# Altium schematic sheet [04] - IC_Power_Monitor_v0.2.SchDoc
size A4
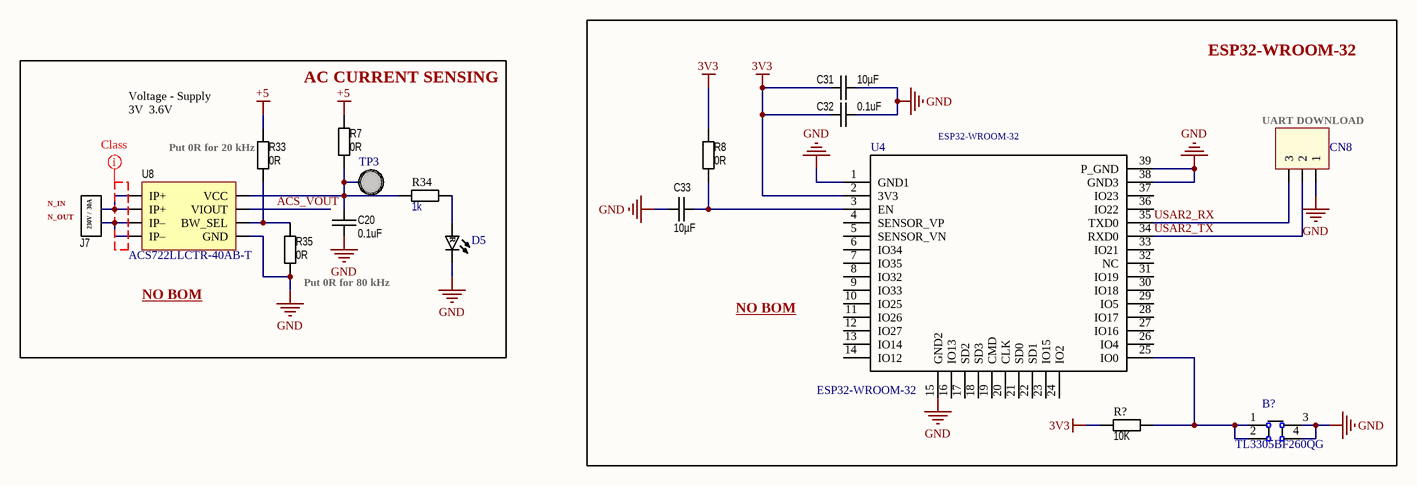
[diagram p0: [04] - IC_Power_Monitor_v0.2.SchDoc]

## Parts
B?  TL3305BF260QG  [Switch]
C20  value 0.1uF  [CAP 0603/1608]  (hidden comment: C0603C104M5RACTU)
C31  value 10µF  [CAP 0603/1608]  (hidden comment: GRM188R61E106MA73D)
C32  value 0.1uF  [CAP 0603/1608]  (hidden comment: C0603C104M5RACTU)
C33  value 10µF  [CAP 0603/1608]  (hidden comment: GRM188R61E106MA73D)
CN8  87220-3  [Terminal_3]  (value not drawn)  (no BOM)
D5  SML-D12U1WT86  [LED-0603]  (value not drawn)
J7  1868076  [30Amp_Connector]  (value not drawn)
R7  value 0R  [R0603]  (hidden comment: RES 0R 0603 JUMPER)
R8  value 0R  [R0603]  (hidden comment: RES 0R 0603 JUMPER)
R33  value 0R  [R0603]  (hidden comment: RES 0R 0603 JUMPER)
R34  value 1k  [R0603]  (hidden comment: RES SMD 1K OHM 5% 1/10W 0603)
R35  value 0R  [R0603]  (hidden comment: RES 0R 0603 JUMPER)
R?  value 10K  [R0603]  (hidden comment: ESR03EZPF1002)
TP3  Test_Point  [TP]  (value not drawn)  (no BOM)
U4  ESP32-WROOM-32  [ESP32-WROOM-32]  (no BOM)
U8  ACS722LLCTR-40AB-T  [SOIC-8]  (no BOM)

## Blocks framed on the sheet
ESP32-WROOM-32: B? C31-C33 CN8 R8 R? U4
AC CURRENT SENSING: C20 D5 J7 R7 R33-R35 TP3 U8

## Nets
3V3: C31.2 C32.1 R8.1 R?.1 U4.2(3V3)
+5: R7.1 R33.1
GND: B?.3 B?.4 C20.2 C31.1 C32.2 C33.1 CN8.1 D5.1 R35.2 U4.1(GND1) U4.15(GND2) U4.38(GND3) U4.39(P_GND) U8.5(GND)
ACS_VOUT: U8.7(VIOUT)
USAR2_RX: CN8.3 U4.35(TXD0)
USAR2_TX: CN8.2 U4.34(RXD0)
NetB?_1: B?.1 B?.2 R?.2 U4.25(IO0)
NetC20_1: C20.1 R7.2 R34.1 TP3.1 U8.8(VCC)
NetC33_2: C33.2 R8.2 U4.3(EN)
NetD5_2: D5.2 R34.2
NetJ7_1: J7.1 U8.3(IP–) U8.4(IP–)
NetJ7_2: J7.2 U8.1(IP+) U8.2(IP+)
NetR33_2: R33.2 R35.1 U8.6(BW_SEL)

Not connected (* = marked no-connect by the designer): U4 4(SENSOR_VP) 5(SENSOR_VN) 6(IO34) 7(IO35) 8(IO32) 9(IO33) 10(IO25) 11(IO26) 12(IO27) 13(IO14) 14(IO12) 16(IO13) 17(SD2) 18(SD3) 19(CMD) 20(CLK) 21(SD0) 22(SD1) 23(IO15) 24(IO2) 26(IO4) 27(IO16) 28(IO17) 29(IO5) 30(IO18) 31(IO19) 32(NC) 33(IO21) 36(IO22) 37(IO23)

## Layout directives
net class creepage: (no net found under the mark)

## Notes on the sheet
- Voltage - Supply	3V  3.6V
- (near CN8) UART DOWNLOAD
- (near J7) N_IN
- (near R33) Put 0R for 20 kHz
- (near J7) N_OUT
- NO BOM
- (near R35) Put 0R for 80 kHz
- (in symbol LED_RED) R
- (in symbol TERM_BLK_02_30A) 230V /  30A

## Library data of the parts
B? = SWITCH: Tactile Switch SPST-NO Top Actuated Surface Mount; Manufacturer: E-Switch; Alternative: *; PartNumber: TL3305BF260QG; Price1: 0.22000; Value: *; Price10: 0.21400; Type: TH; Price100: 0.18790; Footprint: =footprintt; Link: https://www.digikey.com/product-detail/en/e-switch/TL3305BF260QG/EG5354CT-ND/5816199
C20 C32 = CAPC_0.1uF_0603_50V: 0.1µF ±20% 50V Ceramic Capacitor X7R 0603 (1608 Metric); Manufacturer: KEMET; Type: SMD; Package: 0603; PartNumber: C0603C104M5RACTU; Price1: 0.10000; Price1000: 0.00974; Link: https://www.digikey.com/product-detail/en/kemet/C0603C104M5RACTU/399-7845-1-ND/3471568; Tolerance: ±20%; Price100: 0.01740; Voltage: 50V; Price10: 0.03900
C31 C33 = CAPC_10uF_0603_25V: 10µF ±20% 25V Ceramic Capacitor X5R 0603 (1608 Metric); Manufacturer: Murata Electronics; Type: SMD; Package: 0603; PartNumber: GRM188R61E106MA73D; Price1: 0.42000; Price1000: 0.11123; Link: https://www.digikey.com/product-detail/en/murata-electronics/GRM188R61E106MA73D/490-7202-1-ND/3900486; Tolerance: ±20%; Price100: 0.17560; Voltage: 25V; Price10: 0.29300
CN8 = CONN_3POS: Connector Header Through Hole 3 position 0.100" (2.54mm); Manufacturer: TE Connectivity AMP Connectors; Availablity: Available; Alternative: *; Package: 0.100" (2.54mm); Type: THT; Link: https://www.digikey.com/product-detail/en/te-connectivity-amp-connectors/87220-3/A26544-ND/298245; PartNumber: 87220-3; Footprint: =Footprint; Price1: 2.57000; Price10: 2.33000; Price100: 1.99710; Price1000: 1.42653; Value: *
D5 = LED_RED: Red 620nm LED Indication - Discrete 2.2V 0603 (1608 Metric); Manufacturer: Rohm Semiconductor; Type: SMD; Alternative: *; Footprint: =Footprint; Link: https://www.digikey.com/product-detail/en/rohm-semiconductor/SML-D12U1WT86/SML-D12U1WT86CT-ND/5843858; Package: 0603 (1608 Metric); PartNumber: SML-D12U1WT86; Availability: Available; Price1: 0.21000; Price10: 0.15500; Price100: 0.07330; Price1000: 0.03826; Value: *
J7 = TERM_BLK_02_30A: 2 Position Wire to Board Terminal Block Horizontal with Board 0.300" (7.62mm) Through Hole; Manufacturer: Phoenix Contact; Type: TH; PartNumber: 1868076; Link: https://www.digikey.com/product-detail/en/phoenix-contact/1868076/277-5840-ND/2511066; Price1: 1.71000; Price100: 1.42740; Footprint: =Footprint; Price10: 1.66000; Price1000: 1.17914
R7 R8 R33 R35 = RES_0R_0603_JUMPER: PartNumber: RC0603JR-070RL; Manufacturer: Yageo; Type: SMT; Package: 0603; Link: https://www.digikey.com/product-detail/en/yageo/RC0603JR-070RL/311-0.0GRTR-ND/726675; Price1: 0.1; Price1000: 0.00396; Price10: 0.022; Price100: 0.0088
R34 = RES_1k_0603_5%: 1 kOhms ±5% 0.1W, 1/10W Chip Resistor 0603 (1608 Metric) Moisture Resistant Thick Film / Do; PartNumber: RC0603JR-071KL; Manufacturer: Yageo; Type: SMD; Package: 0603; Link: https://www.digikey.com/product-detail/en/yageo/RC0603JR-071KL/311-1.0KGRCT-ND/729624; Price1: 0.10000; Price1000: 0.00347; Price100: 0.00770; Price10: 0.01900; Tolerance: ±5%
R? = RES_10K: 10 kOhms ±1% 0.25W, 1/4W Chip Resistor 0603 (1608 Metric) Automotive AEC-Q200, Pulse Withstanding Thick Film; Manufacturer: Rohm Semiconductor; Type: SMD; Package: 0603 (1608 Metric); PartNumber: ESR03EZPF1002; Link: https://www.digikey.com/product-detail/en/rohm-semiconductor/ESR03EZPF1002/RHM10KADCT-ND/1983753; Price1: 0.13000; Price1000: 0.02033; Alternative: *; Footprint: =Footprint; Price10: 0.12000; Price100: 0.04620; Availability: Available
U4 = ESP32-WROOM-32: Bluetooth, WiFi  Transceiver Module 2.4GHz ~ 2.5GHz  Surface Mount; Manufacturer: Espressif Systems; Alternative: *; Footprint: =Footprint; Link: https://www.digikey.com/product-detail/en/espressif-systems/ESP32-WROOM-32/1904-1010-1-ND/8544305; PartNumber: ESP32-WROOM-32; Type: SMD; Price1: 3.80000; Price10: 3.80000; Price100: 3.80000; Price1000: 3.80000; Value: *
U8 = ACS722: Current Sensor 40A 1 Channel Hall Effect, Open Loop Bidirectional 8-SOIC (0.154", 3.90mm Width); Manufacturer: Allegro MicroSystems; Type: SMD; Package: 8SOIC; PartNumber: ACS722LLCTR-40AB-T; Price1: 5.27000; Price1000: 2.24895; Link: https://www.digikey.com/product-detail/en/allegro-microsystems/ACS722LLCTR-40AB-T/620-1639-1-ND/4948875https://www.digikey.com/product-detail/en/allegro-microsystems/ACS722LLCTR-40AB-T/620-1639-1-ND/4948875https://www.digikey.com/product-detail/en/allegro-microsystems/ACS722LLCTR-40AB-T/620-1639-1-ND/4948875https://www.digikey.com/product-detail/en/allegro-microsystems/ACS722LLCTR-40AB-T/620-1639-1-ND/4948875https://www.digikey.com/product-detail/en/allegro-microsystems/ACS722LLCTR-40AB-T/620-1639-1-ND/4948875https://www.digikey.com/product-detail/en/allegro-microsystems/ACS722LLCTR-40AB-T/620-1639-1-ND/4948875https://www.digikey.com/product-detail/en/allegro-microsystems/ACS722LLCTR-40AB-T/620-1639-1-ND/4948875https://www.digikey.com/product-detail/en/allegro-microsystems/ACS722LLCTR-40AB-T/620-1639-1-ND/4948875https://www.digikey.com/product-detail/en/allegro-microsystems/ACS722LLCTR-40AB-T/620-1639-1-ND/4948875https://www.digikey.com/product-detail/en/allegro-microsystems/ACS722LLCTR-40AB-T/620-1639-1-ND/4948875https://www.digikey.com/product-detail/en/allegro-microsystems/ACS722LLCTR-40AB-T/620-1639-1-ND/4948875https://www.digikey.com/product-detail/en/allegro-microsystems/ACS722LLCTR-40AB-T/620-1639-1-ND/4948875https://www.digikey.com/product-detail/en/allegro-microsystems/ACS722LLCTR-40AB-T/620-1639-1-ND/4948875https://www.digikey.com/product-detail/en/allegro-microsystems/ACS722LLCTR-40AB-T/620-1639-1-ND/4948875https://www.digikey.com/product-detail/en/allegro-microsystems/ACS722LLCTR-40AB-T/620-1639-1-ND/4948875https://www.digikey.com/product-detail/en/allegro-microsystems/ACS722LLCTR-40AB-T/620-1639-1-ND/4948875https://www.digikey.com/product-detail/en/allegro-microsystems/ACS722LLCTR-40AB-T/620-1639-1-ND/4948875https://www.digikey.com/product-detail/en/allegro-microsystems/ACS722LLCTR-40AB-T/620-1639-1-ND/4948875https://www.digikey.com/product-detail/en/allegro-microsystems/ACS722LLCTR-40AB-T/620-1639-1-ND/4948875; Price100: 2.86940; Price10: 4.11000